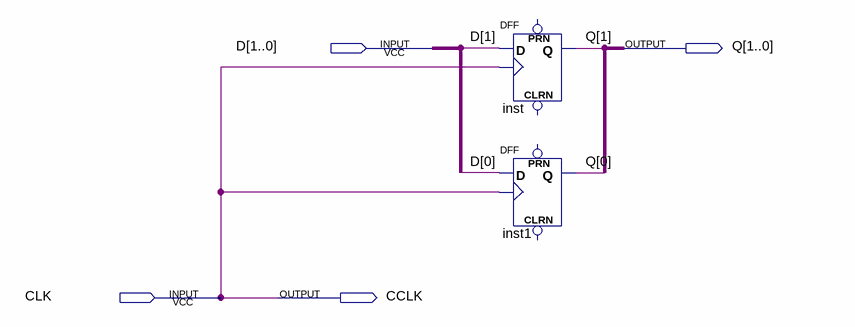
[diagram p0: schematic sheet]
// Quartus schematic DFFs.bdf as structural Verilog: 2 symbols, 4 pins
module DFFs (
  input  [1:0] D,
  input  CLK,
  output [1:0] Q,
  output CCLK
);

  DFF inst (.CLK(CLK), .D(D[1]), .Q(Q[1]));  // open: CLRN, PRN
  DFF inst1 (.CLK(CLK), .D(D[0]), .Q(Q[0]));  // open: CLRN, PRN

  assign CCLK = CLK;
endmodule
